# Altium schematic sheet Jamali.SchDoc
size A4
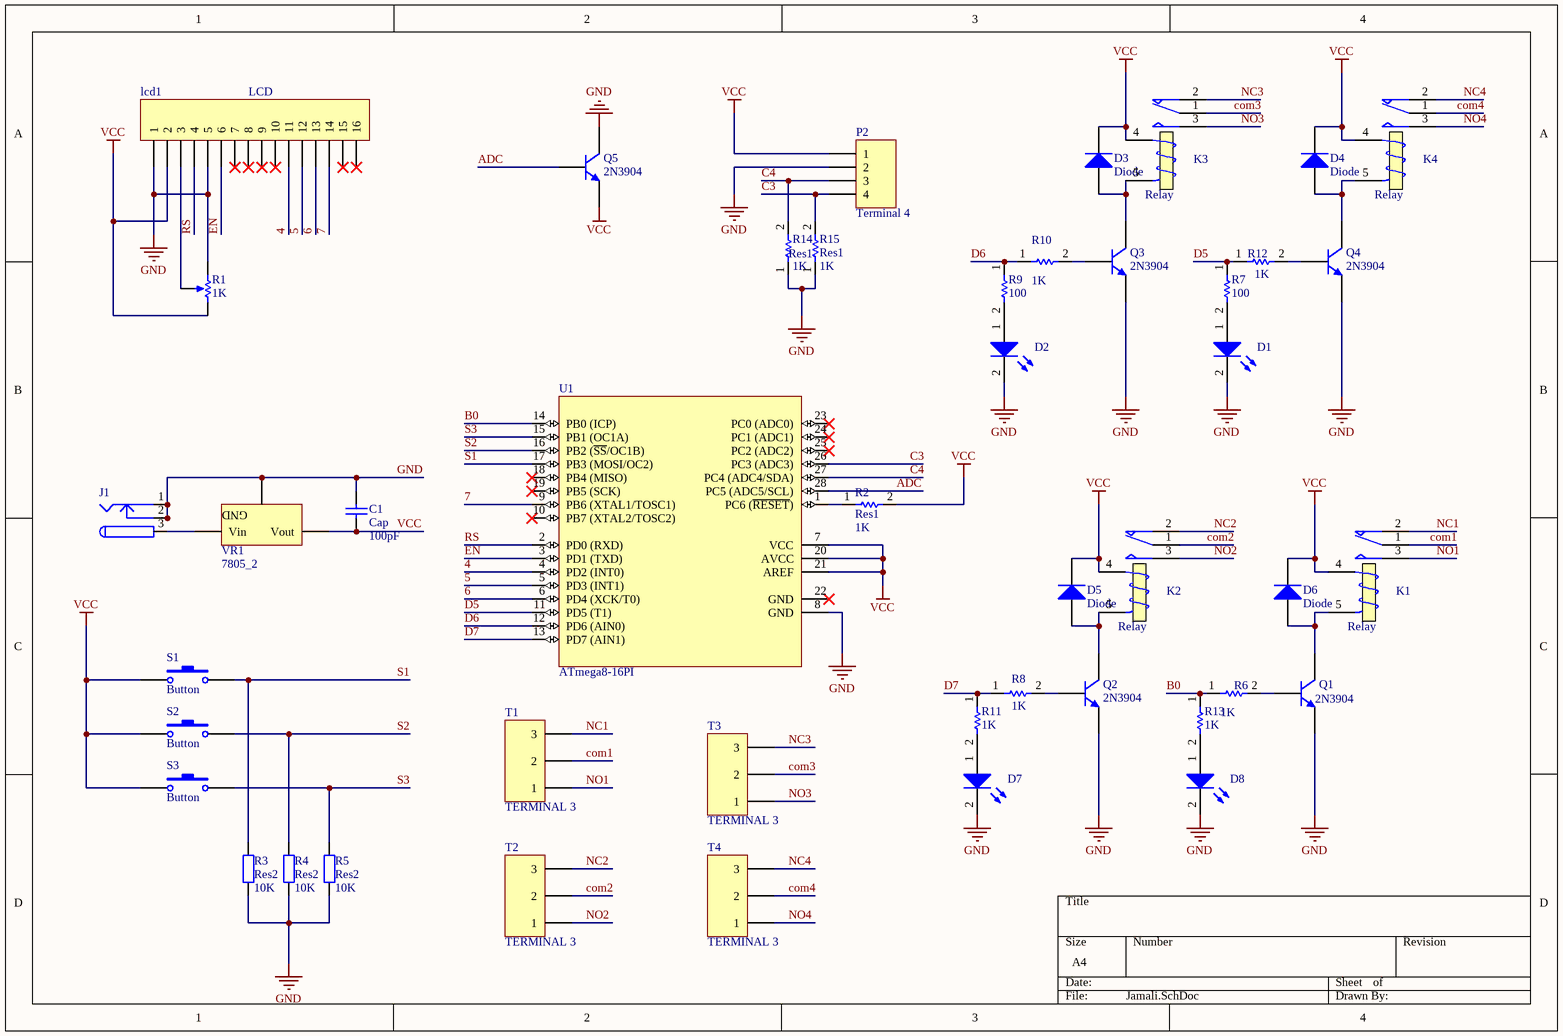
[diagram p0: Jamali.SchDoc]

## Parts
C1  Cap  value 100pF  [C2.5-3]
D1  LED0  [LED3MM]  (value not drawn)
D2  LED0  [LED3MM]  (value not drawn)
D3  Diode  [DO35-7]
D4  Diode  [DO35-7]
D5  Diode  [DO35-7]
D6  Diode  [DO35-7]
D7  LED0  [LED3MM]  (value not drawn)
D8  LED0  [LED3MM]  (value not drawn)
J1  (no value)  [jack]
K1  Relay  [ZF112]
K2  Relay  [ZF112]
K3  Relay  [ZF112]
K4  Relay  [ZF112]
lcd1  LCD  [TUXGR_16X2_R2]
P2  Terminal 4  [AK500/4-H]
Q1  2N3904  [TO92D]
Q2  2N3904  [TO92D]
Q3  2N3904  [TO92D]
Q4  2N3904  [TO92D]
Q5  2N3904  [TO92D]
R1  value 1K  [Pot_2]
R2  Res1  value 1K  [0204/7]
R3  Res2  value 10K  [0204/7]
R4  Res2  value 10K  [0204/7]
R5  Res2  value 10K  [0204/7]
R6  value 1K  [0204/7]  (hidden comment: Res1)
R7  value 100  [0204/7]  (hidden comment: Res1)
R8  value 1K  [0204/7]  (hidden comment: Res1)
R9  value 100  [0204/7]  (hidden comment: Res1)
R10  value 1K  [0204/7]  (hidden comment: Res1)
R11  value 1K  [0204/7]  (hidden comment: Res1)
R12  value 1K  [0204/7]  (hidden comment: Res1)
R13  value 1K  [0204/7]  (hidden comment: Res1)
R14  Res1  value 1K  [0204/7]
R15  Res1  value 1K  [0204/7]
S1  Button  [B3F-10XX]
S2  Button  [B3F-10XX]
S3  Button  [B3F-10XX]
T1  TERMINAL 3  [AK500/3-H]
T2  TERMINAL 3  [AK500/3-H]
T3  TERMINAL 3  [AK500/3-H]
T4  TERMINAL 3  [AK500/3-H]
U1  ATmega8-16PI  [DIL28-3]
VR1  7805_2  [TO220H]

## Nets
GND: C1.2 D1.2 D2.2 D7.2 D8.2 J1.1 J1.2 J1.3 lcd1.1 lcd1.5 P2.2 Q1.E Q2.E Q3.E Q4.E Q5.C R1.1(TOP) R3.1 R4.1 R5.1 R14.1 R15.1 U1.8(GND) VR1.2(GND)
VCC: C1.1 D3.2(K) D4.2(K) D5.2(K) D6.2(K) K1.4(T1) K2.4(T1) K3.4(T1) K4.4(T1) lcd1.2 P2.1 Q5.E R1.3(BOT) R2.2 S1.1 S2.1 S3.1 U1.7(VCC) U1.20(AVCC) U1.21(AREF) VR1.3(Vout)
4: lcd1.11 U1.4(PD2_(INT0))
5: lcd1.12 U1.5(PD3_(INT1))
6: lcd1.13 U1.6(PD4_(XCK/T0))
7: lcd1.14 U1.9(PB6_(XTAL1/TOSC1))
ADC: Q5.B U1.28(PC5_(ADC5/SCL))
B0: R6.1 R13.1 U1.14(PB0_(ICP))
C3: P2.4 R15.2 U1.26(PC3_(ADC3))
C4: P2.3 R14.2 U1.27(PC4_(ADC4/SDA))
com1: K1.1(COM) T1.2
com2: K2.1(COM) T2.2
com3: K3.1(COM) T3.2
com4: K4.1(COM) T4.2
D5: R7.1 R12.1 U1.11(PD5_(T1))
D6: R9.1 R10.1 U1.12(PD6_(AIN0))
D7: R8.1 R11.1 U1.13(PD7_(AIN1))
EN: lcd1.6 U1.3(PD1_(TXD))
NC1: K1.2(NC) T1.3
NC2: K2.2(NC) T2.3
NC3: K3.2(NC) T3.3
NC4: K4.2(NC) T4.3
NO1: K1.3(NO) T1.1
NO2: K2.3(NO) T2.1
NO3: K3.3(NO) T3.1
NO4: K4.3(NO) T4.1
RS: lcd1.4 U1.2(PD0_(RXD))
S1: R3.2 S1.2 U1.17(PB3_(MOSI/OC2))
S2: R4.2 S2.2 U1.16(PB2_(~{SS}/OC1B))
S3: R5.2 S3.2 U1.15(PB1_(OC1A))
NetD1_1: D1.1 R7.2
NetD2_1: D2.1 R9.2
NetD3_1: D3.1(A) K3.5(T2) Q3.C
NetD4_1: D4.1(A) K4.5(T2) Q4.C
NetD5_1: D5.1(A) K2.5(T2) Q2.C
NetD6_1: D6.1(A) K1.5(T2) Q1.C
NetD7_1: D7.1 R11.2
NetD8_1: D8.1 R13.2
NetJ1_3: J1.3 VR1.1(Vin)
Netlcd1_3: lcd1.3 R1.2(TAP)
NetQ1_B: Q1.B R6.2
NetQ2_B: Q2.B R8.2
NetQ3_B: Q3.B R10.2
NetQ4_B: Q4.B R12.2
NetR2_1: R2.1 U1.1(PC6_(~{RESET}))

Not connected (* = marked no-connect by the designer): lcd1 7* 8* 9* 10* 15* 16*; U1 10(PB7_(XTAL2/TOSC2))* 18(PB4_(MISO))* 19(PB5_(SCK))* 22(GND)* 23(PC0_(ADC0))* 24(PC1_(ADC1))* 25(PC2_(ADC2))*

## Library data of the parts
C1 = Cap: Capacitor; Published: 8-Jun-2000; LatestRevisionDate: 17-Jul-2002; LatestRevisionNote: Re-released for DXP Platform.; PackageReference: RAD-0.3; Publisher: Altium Limited
D1 D2 D7 D8 = LED0: Typical INFRARED GaAs LED; Published: 8-Jun-2000; LatestRevisionDate: 08-Jul-2005; LatestRevisionNote: Mech Layer 1 removed.; PackageReference: LED-0; Publisher: Altium Limited
J1 = Jack: Low Voltage Power Supply Connector; Published: 17-Dec-2003; DatasheetDocument: 09-May-2002; Publisher: Altium Limited; ComponentLink1Description: Manufacturer Link; ComponentLink1URL: http://domino.kycon.com/internet/Products.html
K1-K4 = Relay: SPDT Relay; Published: 8-Jun-2000; LatestRevisionDate: 17-Jul-2002; LatestRevisionNote: Re-released for DXP Platform.; PackageReference: MODULE5B; Publisher: Altium Limited
P2 = Terminal 4: Header, 4-Pin; LatestRevisionDate: 17-Jul-2002; LatestRevisionNote: Re-released for DXP Platform.; Publisher: Altium Limited
Q1-Q5 = 2N3904: NPN General Purpose Amplifier; Published: 8-Jun-2000; LatestRevisionDate: 15-Jan-2003; LatestRevisionNote: PCB Footprint 'BCY-W3/D4.7' replaced; DatasheetDocument: 1997; PackageDocument: Sep-1998; PackageReference: TO-92A; Publisher: Altium Limited; Code_JEDEC: TO-92A; ComponentLink1Description: Manufacturer Link; ComponentLink1URL: http://www.fairchildsemi.com/; ComponentLink2Description: Datasheet; ComponentLink2URL: http://www.fairchildsemi.com/ds/2N%2F2N3904.pdf
R1 = pot_2: Potentiometer; Sim Note: Enter the Resistance value and the set point into parameter fields.; Set Position: 0.5; Published: 8-Jun-2000; LatestRevisionDate: 17-Jul-2002; LatestRevisionNote: Re-released for DXP Platform.; PackageReference: VR5; Publisher: Altium Limited
R2 R6-R15 = Res1: Resistor; Published: 8-Jun-2000; LatestRevisionDate: 17-Jul-2002; LatestRevisionNote: Re-released for DXP Platform.; PackageReference: AXIAL-0.3; Publisher: Altium Limited
R3-R5 = Res2: Resistor; Published: 8-Jun-2000; LatestRevisionDate: 17-Jul-2002; LatestRevisionNote: Re-released for DXP Platform.; PackageReference: AXIAL-0.4; Publisher: Altium Limited
S1-S3 = Button: Switch; Published: 24-Mar-1999; LatestRevisionDate: 17-Jul-2002; LatestRevisionNote: Re-released for DXP Platform.; PackageReference: SPST-2; Publisher: Altium Limited
U1 = ATmega8-16PI: 8-Bit AVR Microcontroller with 8K Bytes of In-System Programmable Flash Memory; PackageDocument: revB, Sep-2001; Published: 17-Sep-2003; LatestRevisionDate: 4-Mar-2005; LatestRevisionNote: Stylized 3D Model Added.; DatasheetDocument: 2486H-AVR-09/02; PackageReference: 28P3; Publisher: Altium Limited; ComponentLink1Description: Manufacturer Link; ComponentLink1URL: http://www.atmel.com; ComponentLink2Description: Datasheet; ComponentLink2URL: http://www.atmel.com/dyn/resources/prod_documents/doc2486.pdf
VR1 = 7805_2: Voltage Regulator; Published: 24-Mar-1999; LatestRevisionDate: 17-Jul-2002; LatestRevisionNote: Re-released for DXP Platform.; PackageReference: D2PAK; Publisher: Altium Limited; Code_JEDEC: SMD-220
D3-D6 = Diode: Published: 8-Jun-2000; LatestRevisionDate: 17-Jul-2002; LatestRevisionNote: Re-released for DXP Platform.; PackageDocument: Sep-1996; PackageReference: SMC; Publisher: Altium Limited; Code_JEDEC: DO-214-AB
lcd1 = LCD: LatestRevisionDate: 17-Jul-2002; LatestRevisionNote: Re-released for DXP Platform.; Publisher: Altium Limited
T1-T4 = TERMINAL 3: LatestRevisionDate: 17-Jul-2002; LatestRevisionNote: Re-released for DXP Platform.; Publisher: Altium Limited